# EAGLE design Rocketometer9DS1_2 (EAGLE 7.3.0)
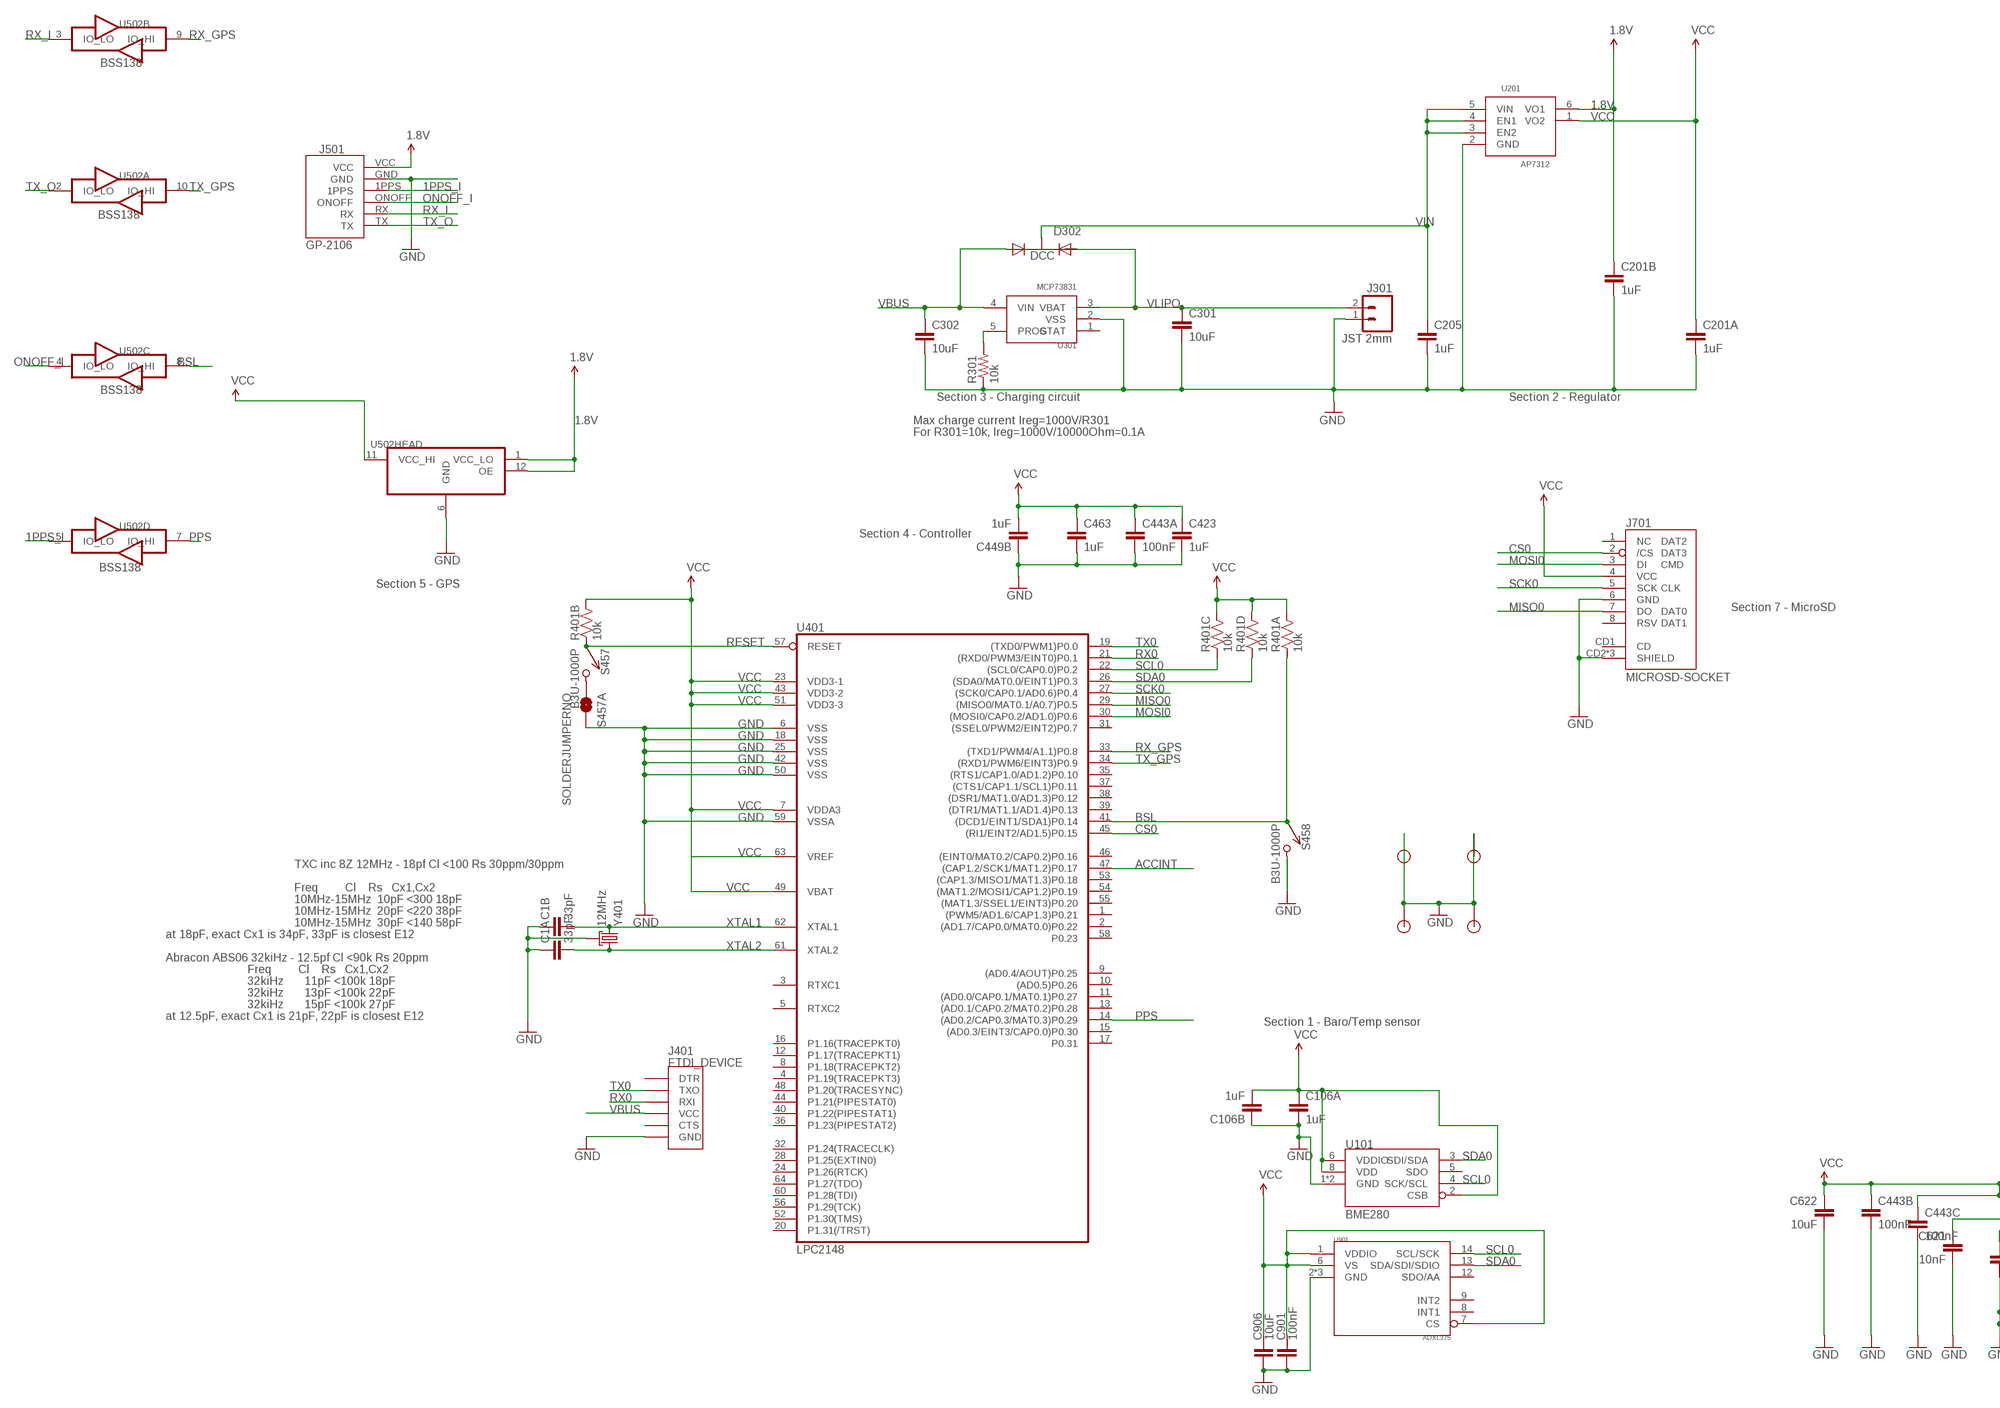
[diagram p0: schematic, sheet 1, part 1 of 2]
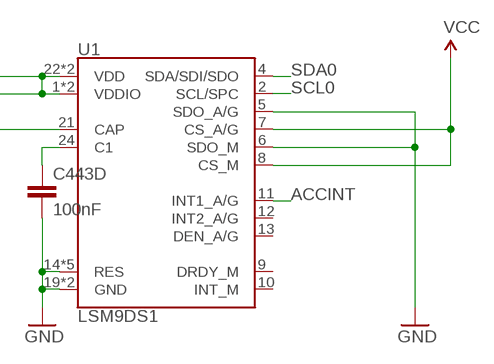
[diagram p1: schematic, sheet 1, part 2 of 2]

## Parts
C1  33pF  CKCM25  [CKCM25]
C106  1uF  CKCM25  [CKCM25]
C201  1uF  CKCM25  [CKCM25]
C205  1uF  CAP0402-CAP  [0402-CAP]
C301  10uF  CAP0402-CAP  [0402-CAP]
C302  10uF  CAP0402-CAP  [0402-CAP]
C423  1uF  CAP0402-CAP  [0402-CAP]
C443  100nF  CKCX4L  [CKCL44]
C449  1uF  CKCM25  [CKCM25]
C463  1uF  CAP0402-CAP  [0402-CAP]
C621  10nF  CAP0402-CAP  [0402-CAP]
C622  10uF  CAP0402-CAP  [0402-CAP]
C901  100nF  CAP0402-CAP  [0402-CAP]
C906  10uF  CAP0402-CAP  [0402-CAP]
D302  DCC  PMEG2005CT  [SOT-23-3]
J301  JST 2mm  M021X02_NO_SILK  [1X02_NO_SILK]
J401  FTDI_DEVICE  [FTDI_DEVICE_SIDE]
J501  GP-2106  [GP-2106]
J701  MICROSD-SOCKET  [MICROSD-SOCKET-PP]
JP1  STANDOFF  [STANDOFF]
JP2  STANDOFF  [STANDOFF]
JP4  STANDOFF  [STANDOFF]
JP5  STANDOFF  [STANDOFF]
R301  10k  RESISTOR0402-RES  [0402-RES]
R401  10k  RP404  [CRA04]
S457  B3U-1000P  [B3U-1000P]
S457A  SOLDERJUMPERNO  [SJ_2S-NO]
S458  B3U-1000P  [B3U-1000P]
U1  LSM9DS1  [LGA24-8X4]
U101  BME280  [BME280]
U201  AP7312  AP73X2  [SOT-23-6]
U301  MCP73831  [SOT-23-5]
U401  LPC2148  LPC213X  [SQFP-S-10X10-64]
U502  TXB0104RUT  [R-PUQFN-N12]
U901  ADXL375  [ADXL375]
Y401  12MHz  CX2520  [CRYSTAL_SMD_2MM_2_5MM]

## Nets
1.8V: C201.2 J501.VCC U201.6(VO1) U502.1(HEAD:VCC_LO) U502.12(HEAD:OE)
1PPS_I: J501.1PPS U502.5(D:IO_LO)
ACCINT: U1.11(INT1_A/G) U401.47((CAP1.2/SCK1/MAT1.2)P0.17)
BSL: R401.1 S458.P$1 U401.41((DCD1/EINT1/SDA1)P0.14) U502.8(C:IO_HI)
C1: C443.4 U1.24(C1)
CAP: C621.1 U1.21(CAP)
CS0: J701.2(/CS) U401.45((RI1/EINT2/AD1.5)P0.15)
GND [power]: C1.1 C1.2 C106.2 C106.4 C201.3 C201.4 C205.2 C301.2 C302.2 C423.2 C443.5 C443.6 C443.7 C443.8 C449.2 C463.2 C621.2 C622.2 C901.2 C906.2 J301.1 J401.P$6(GND) J501.GND J701.6(GND) J701.CD2(SHIELD) J701.GND1(SHIELD) J701.GND3(SHIELD) JP1.P$1 JP2.P$1 JP4.P$1 JP5.P$1 R301.1 S457A.2 S458.P$2 U1.5(SDO_A/G) U1.6(SDO_M) U1.14(RES) U1.15(RES) U1.16(RES) U1.17(RES) U1.18(RES) U1.19(GND) U1.20(GND) U101.1(GND) U101.7(GND) U201.2(GND) U301.2(VSS) U401.6(VSS) U401.18(VSS) U401.25(VSS) U401.42(VSS) U401.50(VSS) U401.59(VSSA) U502.6(HEAD:GND) U901.2(GND) U901.4(GND) U901.5(GND) Y401.2(GND) Y401.4(GND)
MISO0: J701.7(DO) U401.29((MISO0/MAT0.1/A0.7)P0.5)
MOSI0: J701.3(DI) U401.30((MOSI0/CAP0.2/AD1.0)P0.6)
N$2: R301.2 U301.5(PROG)
N$8: S457.P$2 S457A.1
ONOFF_I: J501.ONOFF U502.4(C:IO_LO)
PPS: U401.14((AD0.2/CAP0.3/MAT0.3)P0.29) U502.7(D:IO_HI)
RESET [power]: R401.2 S457.P$1 U401.57(RESET)
RX0: J401.P$3(RXI) U401.21((RXD0/PWM3/EINT0)P0.1)
RX_GPS: U401.33((TXD1/PWM4/A1.1)P0.8) U502.9(B:IO_HI)
RX_I: J501.RX U502.3(B:IO_LO)
SCK0: J701.5(SCK) U401.27((SCK0/CAP0.1/AD0.6)P0.4)
SCL0: R401.3 U1.2(SCL/SPC) U101.4(SCK/SCL) U401.22((SCL0/CAP0.0)P0.2) U901.14(SCL/SCK)
SDA0: R401.4 U1.4(SDA/SDI/SDO) U101.3(SDI/SDA) U401.26((SDA0/MAT0.0/EINT1)P0.3) U901.13(SDA/SDI/SDIO)
TX0: J401.P$2(TXO) U401.19((TXD0/PWM1)P0.0)
TX_GPS: U401.34((RXD1/PWM6/EINT3)P0.9) U502.10(A:IO_HI)
TX_O: J501.TX U502.2(A:IO_LO)
VBUS [power]: C302.1 D302.1(A1) J401.P$4(VCC) U301.4(VIN)
VCC [power]: C106.1 C106.3 C201.1 C423.1 C443.1 C443.2 C443.3 C449.3 C463.1 C622.1 C901.1 C906.1 J701.4(VCC) R401.5 R401.6 R401.7 R401.8 U1.1(VDDIO) U1.3(VDDIO) U1.7(CS_A/G) U1.8(CS_M) U1.22(VDD) U1.23(VDD) U101.2(CSB) U101.6(VDDIO) U101.8(VDD) U201.1(VO2) U401.7(VDDA3) U401.23(VDD3-1) U401.43(VDD3-2) U401.49(VBAT) U401.51(VDD3-3) U401.63(VREF) U502.11(HEAD:VCC_HI) U901.1(VDDIO) U901.6(VS) U901.7(CS)
VIN: C205.1 D302.3(K) U201.3(EN2) U201.4(EN1) U201.5(VIN)
VLIPO [power]: C301.1 D302.2(A2) J301.2 U301.3(VBAT)
XTAL1: C1.3 U401.62(XTAL1) Y401.3
XTAL2: C1.4 U401.61(XTAL2) Y401.1
Unconnected: C449.1 C449.4 J401.P$1(DTR) J401.P$5(CTS) J701.1(NC) J701.8(RSV) J701.CD1(CD) U1.9(DRDY_M) U1.10(INT_M) U1.12(INT2_A/G) U1.13(DEN_A/G) U101.5(SDO) U301.1(STAT) U401.1((PWM5/AD1.6/CAP1.3)P0.21) U401.2((AD1.7/CAP0.0/MAT0.0)P0.22) U401.3(RTXC1) U401.4(P1.19(TRACEPKT3)) U401.5(RTXC2) U401.8(P1.18(TRACEPKT2)) U401.9((AD0.4/AOUT)P0.25) U401.10((AD0.5)P0.26) U401.11((AD0.0/CAP0.1/MAT0.1)P0.27) U401.12(P1.17(TRACEPKT1)) U401.13((AD0.1/CAP0.2/MAT0.2)P0.28) U401.15((AD0.3/EINT3/CAP0.0)P0.30) U401.16(P1.16(TRACEPKT0)) U401.17(P0.31) U401.20(P1.31(/TRST)) U401.24(P1.26(RTCK)) U401.28(P1.25(EXTIN0)) U401.31((SSEL0/PWM2/EINT2)P0.7) U401.32(P1.24(TRACECLK)) U401.35((RTS1/CAP1.0/AD1.2)P0.10) U401.36(P1.23(PIPESTAT2)) U401.37((CTS1/CAP1.1/SCL1)P0.11) U401.38((DSR1/MAT1.0/AD1.3)P0.12) U401.39((DTR1/MAT1.1/AD1.4)P0.13) U401.40(P1.22(PIPESTAT1)) U401.44(P1.21(PIPESTAT0)) U401.46((EINT0/MAT0.2/CAP0.2)P0.16) U401.48(P1.20(TRACESYNC)) U401.52(P1.30(TMS)) U401.53((CAP1.3/MISO1/MAT1.3)P0.18) U401.54((MAT1.2/MOSI1/CAP1.2)P0.19) U401.55((MAT1.3/SSEL1/EINT3)P0.20) U401.56(P1.29(TCK)) U401.58(P0.23) U401.60(P1.28(TDI)) U401.64(P1.27(TDO)) U901.8(INT1) U901.9(INT2) U901.12(SDO/AA)

## Notes on the sheet
- BSS138
- BSS138
- BSS138
- Section 3 - Charging circuit | Section 2 - Regulator
- Max charge current Ireg=1000V/R301
- For R301=10k, Ireg=1000V/10000Ohm=0.1A
- Section 4 - Controller
- BSS138
- Section 5 - GPS
- Section 7 - MicroSD
- TXC inc 8Z 12MHz - 18pf Cl <100 Rs 30ppm/30ppm
- Freq         Cl    Rs   Cx1,Cx2
- 10MHz-15MHz  10pF <300 18pF
- 10MHz-15MHz  20pF <220 38pF
- 10MHz-15MHz  30pF <140 58pF
- at 18pF, exact Cx1 is 34pF, 33pF is closest E12
- Abracon ABS06 32kiHz - 12.5pf Cl <90k Rs 20ppm
- Freq         Cl    Rs   Cx1,Cx2
- 32kiHz       11pF <100k 18pF
- 32kiHz       13pF <100k 22pF
- 32kiHz       15pF <100k 27pF
- at 12.5pF, exact Cx1 is 21pF, 22pF is closest E12
- Section 1 - Baro/Temp sensor

## Library data of the parts
C1 C106 C201 C449 = KwanSystems:CKC
C205 C423 C463 = SparkFun:CAP: Capacitor Standard 0603 ceramic capacitor, and 0.1" leaded capacitor.; DIGIKEY: 445-4114-1-ND
C301 C302 = SparkFun:CAP: Capacitor Standard 0603 ceramic capacitor, and 0.1" leaded capacitor.; DIGIKEY: 445-7395-1-ND
C443 = KwanSystems:CKCX4
C621 C622 = SparkFun-Capacitors:CAP: Capacitor Standard 0603 ceramic capacitor, and 0.1" leaded capacitor.
C901 = SparkFun-Passives:CAP: Capacitor Standard 0603 ceramic capacitor, and 0.1" leaded capacitor.; DIGIKEY: 445-1265-1-ND
C906 = SparkFun-Capacitors:CAP: Capacitor Standard 0603 ceramic capacitor, and 0.1" leaded capacitor.; DIGIKEY: 445-7486-1-ND
D302 = KwanSystems:PMEG2005CT; DIGIKEY: 568-6500-1-ND
J301 = SparkFun-Connectors:M02: Standard 2-pin 0.1" header. Use with - straight break away headers ( PRT-00116) - right angle break away headers (PRT-00553) - swiss pins (PRT-00743) - machine pins (PRT-00117) - female headers (PRT-00115) Molex polarized connector foot print use with: PRT-08233 with associated crimp pins and housings. 2.54_SCREWTERM for use with PRT-10571. 3.5mm Screw Terminal footprints for PRT-08084 5mm Screw Terminal footprints for use with PRT-08432; DIGIKEY: 455-1749-1-ND
J401 = SparkFun-Connectors:FTDI_DEVICE: Connector which mates to FTDI basic or FTDI cable.
J501 = SparkFun:GP-2106: GP-2106 GPS SiRF IV
J701 = KwanSystems:MICROSD-SOCKET: microSD Socket Push-push type uSD socket. Digikey 101-00660-68-6-1-ND. tDoc lines correctly indicate media card edge positions when inserting (unlocked, locked, depressed).; DIGIKEY: 101-00581-59-1-ND
JP1 JP2 JP4 JP5 = KwanSystems:STANDOFF; DIGIKEY: $NOPART
R301 = SparkFun:RESISTOR: Resistor Basic schematic elements and footprints for 0603, 1206, and PTH resistors.; DIGIKEY: P10.0KLCT-ND
R401 = KwanSystems:RP4; DIGIKEY: CRA4S810KCT-ND
S457 S458 = KwanSystems:B3U-1000P; DIGIKEY: SW1020CT-ND
S457A = SparkFun-Passives:SOLDERJUMPER: Solder Jumper Standard SMD solder jumper. Used to automate production. Two varients : Normally Open and Normally Closed are the same, but have different paste layers. NC will have a large amount of paste and should jumper during reflow.; DIGIKEY: $NOPART
U1 = LSM9DS1_temp:LSM9DS1: LSM9DS1 3D accelerometer, gyroscope & magnetometer The LSM9DS1 is a system-in-package featuring a 3D digital linear acceleration sensor, a 3D digital angular rate sensor, and a 3D digital magnetic sensor. The LSM9DS1 has a linear acceleration full scale of ±2g/±4g/±8/±16 g, a magnetic field full scale of ±4/±8/±12/±16 gauss and an angular rate of ±245/±500/±2000 dps. The LSM9DS1 includes an I2 C serial bus interface supporting standard and fast mode (100 kHz and 400 kHz) and an SPI serial standard interface. Magnetic, accelerometer and gyroscope sensing can be enabled or set in power-down mode separately for smart power management. The LSM9DS1 is available in a plastic land grid array package (LGA) and it is guaranteed to operate over an extended temperature range from -40 °C to +85 °C.; PROD_ID: IC-12536
U101 = KwanSystems:BME280
U201 = KwanSystems:AP73X2: Dual 300mA LDO Regulator http://www.diodes.com/datasheets/AP7332.pdf
U301 = KwanSystems:MCP73831; DIGIKEY: 576-1910-1-ND
U401 = SparkFun:LPC213X: LPC213x Schematic element and footprint for NXP LPC213x. Spark Fun Electronics SKU : COM-00520; DIGIKEY: 568-1765-ND
U502 = KwanSystems:TXB0104
U901 = KwanSystems:ADXL375
Y401 = KwanSystems:CX2520; DIGIKEY: 887-1487-1-ND

## Net classes
0 default: width 0.152 mm, drill 0.33 mm, clearance 0.152 mm
1 power: width 0.152 mm, drill 0.33 mm, clearance 0.152 mm to class 0, clearance 0.152 mm
2 hv: width 0.152 mm, drill 0.33 mm, clearance 0.152 mm to class 0, clearance 0.152 mm to class 1, clearance 0.152 mm

## Board
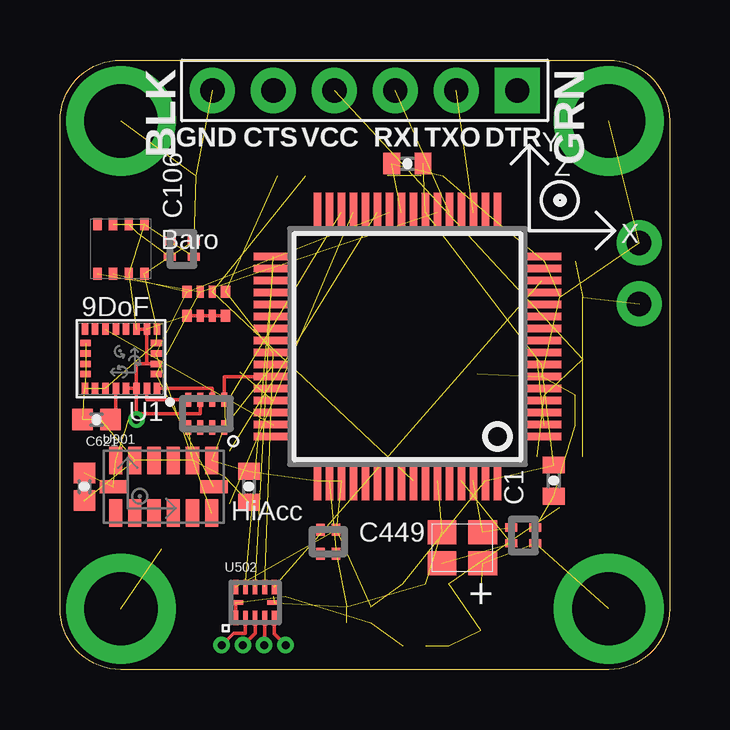
[diagram p2: board, top side]
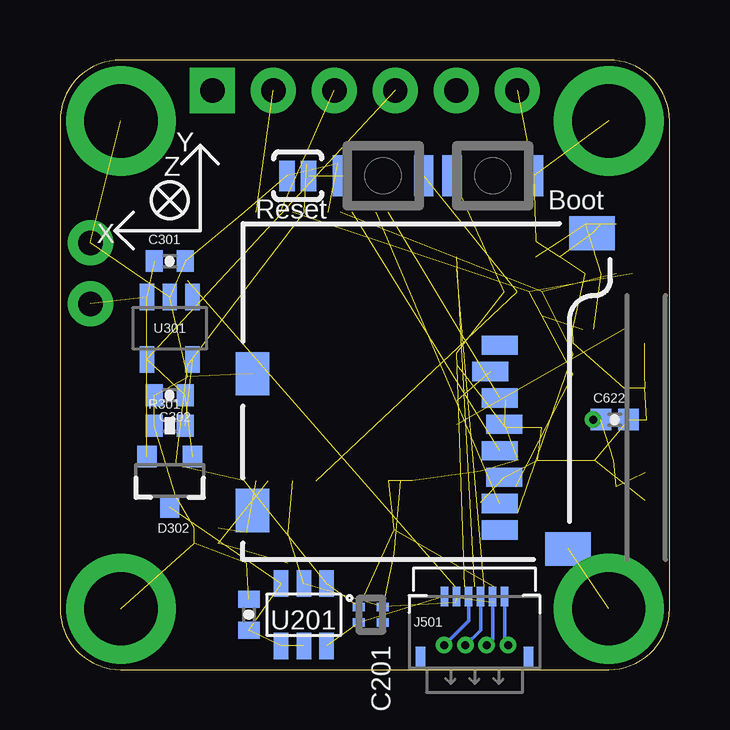
[diagram p3: board, bottom side, seen from below]

Size 25.4 x 25.4 mm. Coordinates in mm from the lower left corner, seen from the top.
Outline: 2.54,25.4 22.86,25.4 arc-90 25.4,22.86 25.4,2.54 arc-90 22.86,0 2.54,0 arc-90 0,2.54 0,22.86 arc-90 2.54,25.4
Copper layers (1*16): Top 0.0356mm / dielectric 1.5011mm / Bottom 0.0356mm
Design rules "default": minimum track width 6mil, minimum drill 13mil, track to track 6mil, track to pad 6mil, pad to pad 6mil, via to via 6mil, smd to smd 6mil, copper to edge 15mil, drill to drill 6mil, minimum pad ring 7mil, minimum via ring 7mil, stop-mask expansion 4mil, vias tented up to drill 14mil, thermal gap 10mil

### Footprints (pad centres in the part's own frame; a part is rotated, then mirrored left to right if it is on the bottom)
CKCM25 = smd 0.35 x 0.5: 1 -0.325,-0.5; 2 0.325,-0.5; 3 0.325,0.5; 4 -0.325,0.5
0402-CAP = smd 0.7 x 0.9: 1 -0.65,0; 2 0.65,0
CKCL44 = smd 0.25 x 0.6: 1 -0.75,-0.575; 2 -0.25,-0.575; 3 0.25,-0.575; 4 0.75,-0.575; 5 0.75,0.575; 6 0.25,0.575; 7 -0.25,0.575; 8 -0.75,0.575
0402-CAP' = smd 0.85 x 0.9: 1 -0.58,0; 2 0.58,0
SOT-23-3 = smd 0.9 x 0.8: 1 -1,0.95; 2 -1,-0.95; 3 1.1,0
1X02_NO_SILK = drill 1.016 pad 1.88: 1 0,0; 2 2.54,0
FTDI_DEVICE_SIDE = drill 1.016 pad 1.88 square: P$1 -6.35,0 | drill 1.016 pad 1.88: P$2 -3.81,0; P$3 -1.27,0; P$4 1.27,0; P$5 3.81,0; P$6 6.35,0
GP-2106 = smd 0.3 x 0.8: 1PPS -0.25,0; GND -0.75,0; ONOFF 0.25,0; RX 0.75,0; TX 1.25,0; VCC -1.25,0 | smd 0.4 x 0.8: P$7 -2.25,-2.5; P$8 2.25,-2.5
MICROSD-SOCKET-PP = smd 0.8 x 1.5: 1 -8.94,10.7; 2 -7.84,10.3; 3 -6.74,10.7; 4 -5.64,10.9; 5 -4.54,10.7; 6 -3.44,10.9; 7 -2.34,10.7; 8 -1.24,10.7 | smd 1.8 x 1.4: CD1 -2.05,0.4; CD2 -7.75,0.4 | smd 1.4 x 1.9: GND1 -13.6,14.55; GND3 -0.45,13.55
STANDOFF = drill 3.048 pad 4.572: P$1 0,0
0402-RES = smd 0.7 x 0.9: 1 -0.65,0; 2 0.65,0
CRA04 = smd 0.4 x 0.5: 1 -0.8,-0.5; 4 0.8,-0.5; 5 0.8,0.5; 8 -0.8,0.5 | smd 0.3 x 0.5: 2 -0.25,-0.5; 3 0.25,-0.5; 6 0.25,0.5; 7 -0.25,0.5
B3U-1000P = smd 0.8 x 1.7: P$1 -1.7,0; P$2 1.7,0
SJ_2S-NO = smd 0.635 x 1.27: 1 -0.45,0; 2 0.45,0
LGA24-8X4 = smd 0.27 x 0.45: 1 -1.505,1.225; 6 -1.505,-1.225; 7 -1.075,-1.225; 8 -0.645,-1.225; 9 -0.215,-1.225; 10 0.215,-1.225; 11 0.645,-1.225; 12 1.075,-1.225; 13 1.505,-1.225; 18 1.505,1.225; 19 1.075,1.225; 20 0.645,1.225; 21 0.215,1.225; 22 -0.215,1.225; 23 -0.645,1.225; 24 -1.075,1.225 | smd 0.45 x 0.27: 2 -1.475,0.645; 3 -1.475,0.215; 4 -1.475,-0.215; 5 -1.475,-0.645; 14 1.475,-0.645; 15 1.475,-0.215; 16 1.475,0.215; 17 1.475,0.645
BME280 = smd 0.35 x 0.5: 1 -0.975,1.025; 2 -0.325,1.025; 3 0.325,1.025; 4 0.975,1.025; 5 0.975,-1.025; 6 0.325,-1.025; 7 -0.325,-1.025; 8 -0.975,-1.025
SOT-23-6 = smd 0.6 x 1.1: 1 -0.95,-1.3; 2 0,-1.3; 3 0.95,-1.3; 4 0.95,1.3; 5 0,1.3; 6 -0.95,1.3
SOT-23-5 = smd 0.6 x 1.1: 1 -0.95,-1.3; 2 0,-1.3; 3 0.95,-1.3; 4 0.95,1.3; 5 -0.95,1.3
SQFP-S-10X10-64 = smd 0.3 x 1.6: 1 -3.75,-5.6; 2 -3.25,-5.6; 3 -2.75,-5.6; 4 -2.25,-5.6; 5 -1.75,-5.6; 6 -1.25,-5.6; 7 -0.75,-5.6; 8 -0.25,-5.6; 9 0.25,-5.6; 10 0.75,-5.6; 11 1.25,-5.6; 12 1.75,-5.6; 13 2.25,-5.6; 14 2.75,-5.6; 15 3.25,-5.6; 16 3.75,-5.6; 33 3.75,5.6; 34 3.25,5.6; 35 2.75,5.6; 36 2.25,5.6; 37 1.75,5.6; 38 1.25,5.6; 39 0.75,5.6; 40 0.25,5.6; 41 -0.25,5.6; 42 -0.75,5.6; 43 -1.25,5.6; 44 -1.75,5.6; 45 -2.25,5.6; 46 -2.75,5.6; 47 -3.25,5.6; 48 -3.75,5.6 | smd 1.6 x 0.3: 17 5.6,-3.75; 18 5.6,-3.25; 19 5.6,-2.75; 20 5.6,-2.25; 21 5.6,-1.75; 22 5.6,-1.25; 23 5.6,-0.75; 24 5.6,-0.25; 25 5.6,0.25; 26 5.6,0.75; 27 5.6,1.25; 28 5.6,1.75; 29 5.6,2.25; 30 5.6,2.75; 31 5.6,3.25; 32 5.6,3.75; 49 -5.6,3.75; 50 -5.6,3.25; 51 -5.6,2.75; 52 -5.6,2.25; 53 -5.6,1.75; 54 -5.6,1.25; 55 -5.6,0.75; 56 -5.6,0.25; 57 -5.6,-0.25; 58 -5.6,-0.75; 59 -5.6,-1.25; 60 -5.6,-1.75; 61 -5.6,-2.25; 62 -5.6,-2.75; 63 -5.6,-3.25; 64 -5.6,-3.75
R-PUQFN-N12 = smd 0.2 x 0.6: 1 -0.8,-0.65; 2 -0.4,-0.65; 3 0,-0.65; 4 0.4,-0.65; 5 0.8,-0.65; 7 0.8,0.65; 8 0.4,0.65; 9 0,0.65; 10 -0.4,0.65; 11 -0.8,0.65 | smd 0.6 x 0.2: 6 0.8,0; 12 -0.8,0
ADXL375 = smd 0.55 x 1.145: 1 2,1.097; 2 1.2,1.097; 3 0.4,1.097; 4 -0.4,1.097; 5 -1.2,1.097; 6 -2,1.097; 8 -2,-1.097; 9 -1.2,-1.097; 10 -0.4,-1.097; 11 0.4,-1.097; 12 1.2,-1.097; 13 2,-1.097 | smd 1.145 x 0.55: 7 -2.098,0; 14 2.098,0
CRYSTAL_SMD_2MM_2_5MM = smd 1.2 x 1: 1 -0.85,-0.65; 2 0.85,-0.65; 3 0.85,0.65; 4 -0.85,0.65

### Placement (x,y rotation side)
C1  19.3,5.59 90 top
C106  5.08,17.53 90 top
C201  12.45,2.29 270 bottom
C205  17.53,2.29 90 bottom
C301  20.83,17.02 0 bottom
C302  20.83,11.43 180 bottom
C423  14.48,21.08 180 top
C443  6.1,10.67 180 top
C449  11.18,5.33 0 top
C463  20.57,7.87 270 top
C621  10nF  [0402-CAP']  1.52,10.41 180 top
C622  10uF  [0402-CAP']  2.29,10.41 0 bottom
C901  7.87,7.62 270 top
C906  10uF  [0402-CAP']  1.02,7.62 270 top
D302  20.83,7.87 270 bottom
J301  24.13,17.78 270 bottom
J401  12.7,24.13 180 top
J501  8.13,3.05 0 bottom
J701  17.78,4.58 270 bottom
JP1  2.54,2.54 0 top
JP2  2.54,22.86 0 top
JP4  22.86,2.54 0 top
JP5  22.86,22.86 0 top
R301  20.83,10.16 0 bottom
R401  6.1,15.24 180 top
S457  11.94,20.57 180 bottom
S457A  15.49,20.57 180 bottom
S458  7.37,20.57 0 bottom
U1  2.54,12.95 180 top
U101  2.54,17.53 180 top
U201  15.24,2.29 180 bottom
U301  20.83,14.22 180 bottom
U401  14.48,13.46 90 top
U502  8.13,2.79 0 top
U901  4.32,7.62 0 top
U$4  [AXES]  19.56,18.29 0 top
Y401  16.76,5.08 0 top

### Tracks (layer width: path | path; a pad name or v marks a point on that pad's centre or on a via)
1.8V  (3 unrouted)
  Top 0.152: U502.1 U502.12
1PPS_I  (via drill 0.33)
  Top 0.152: U502.5 8.93,1.49 v9.4,1.02
  Bottom 0.152: v9.4,1.02 8.38,2.04 J501.1PPS
ACCINT  (1 unrouted)
BSL  (3 unrouted)
C1
  Top 0.152: U1.24 3.62,11.24 C443.4
CAP
  Top 0.152: U1.21 2.33,10.63 C621.1
CS0  (1 unrouted)
GND  (55 unrouted)
MISO0  (1 unrouted)
MOSI0  (1 unrouted)
N$2  (1 unrouted)
N$8  (1 unrouted)
ONOFF_I  (via drill 0.33)
  Top 0.152: U502.4 8.53,1.03 arc-90 v8.51,1.02
  Bottom 0.152: J501.ONOFF 7.88,1.65 v8.51,1.02
PPS  (1 unrouted)
RESET  (2 unrouted)
RX0  (1 unrouted)
RX_GPS  (1 unrouted)
RX_I  (via drill 0.33)
  Top 0.152: U502.3 8.13,1.52 v7.62,1.02
  Bottom 0.152: v7.62,1.02 7.38,1.26 J501.RX
SCK0  (1 unrouted)
SCL0  (4 unrouted)
SDA0  (4 unrouted)
TX0  (1 unrouted)
TX_GPS  (1 unrouted)
TX_O  (via drill 0.33)
  Top 0.152: U502.2 7.73,1.52 7.24,1.52 v6.73,1.02
  Bottom 0.152: v6.73,1.02 6.88,1.16 J501.TX
VBUS  (3 unrouted)
VCC  (via drill 0.33)  (23 unrouted)
  Top 0.152: U401.43 6.85,12.21 C443.1 C443.2 | C443.2 6.35,11.73 U1.1 | C443.2 C443.3 5.85,10.67 3.19,10.67 | 3.19,10.67 U1.23 | U1.22 U1.23 | v3.19,10.41 3.19,10.67 | R401.8 R401.7 R401.6 R401.5 | U1.8 U1.7 3.62,12.74 U1.3 3.19,12.74 U1.23
  Bottom 0.152: C622.1 v3.19,10.41
VIN  (4 unrouted)
VLIPO  (3 unrouted)
XTAL1  (2 unrouted)
XTAL2  (2 unrouted)

### Text on the board
tPlace: Baro | 9DoF | HiAcc | +
bPlace: Boot | Reset